# Altium schematic sheet LTC3260.SchDoc
size A4
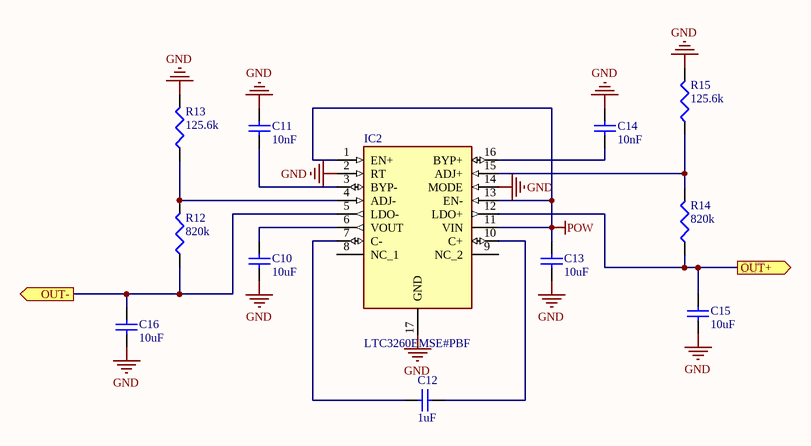
[diagram p0: LTC3260.SchDoc]

## Parts
C10  10uF  [0805 CAP]
C11  10nF  [0603 RES]
C12  1uF  [0805 CAP]
C13  10uF  [0805 CAP]
C14  10nF  [0603 RES]
C15  10uF  [0805 CAP]
C16  10uF  [0805 CAP]
IC2  LTC3260EMSE#PBF  [SOP50P490X110-17N]
R12  value 820k  [0603 RES]  (hidden comment: Résistance)
R13  value 125.6k  [0603 RES]  (hidden comment: Résistance)
R14  value 820k  [0603 RES]  (hidden comment: Résistance)
R15  value 125.6k  [0603 RES]  (hidden comment: Résistance)

## Ports
OUT+ (out), OUT- (out)

## Nets
GND: C10.2 C11.1 C13.1 C14.2 C15.2 C16.2 IC2.2(RT) IC2.14(MODE) IC2.17(GND) R13.2 R15.2
POW: C13.2 IC2.1(EN+) IC2.11(VIN) IC2.13(EN-)
OUT+: C15.1 IC2.12(LDO+) R14.1 ; port OUT+
OUT-: C16.1 IC2.5(LDO-) R12.1 ; port OUT-
NetC10_1: C10.1 IC2.6(VOUT)
NetC11_2: C11.2 IC2.3(BYP-)
NetC12_1: C12.1 IC2.7(C-)
NetC12_2: C12.2 IC2.10(C+)
NetC14_1: C14.1 IC2.16(BYP+)
NetIC2_4: IC2.4(ADJ-) R12.2 R13.1
NetIC2_15: IC2.15(ADJ+) R14.2 R15.1

Not connected (* = marked no-connect by the designer): IC2 8(NC_1) 9(NC_2)

## Library data of the parts
C10 C13 C15 C16 = 1uF/0805: Manufacturer: Murata; Manufacturer Part Number: GCM21BR7YA105KA55L; Capacitance: 10 µF; Dielectric: X7R; Tolerance (%): ±10 %; Rated Voltage: 35 V; Supplier 1: Farnell; Stock 1: 3630; Pricing 1: 5=0.391, 50=0.21, 250=0.162, 500=0.111 (EUR); Case Size/Dimension: 0805; ComponentLink1URL: https://datasheet.ciiva.com/11616/product-11616620.pdf; ComponentLink1Description: https://datasheet.ciiva.com/11616/product-11616620.pdf; ComponentLink2URL: https://datasheet.ciiva.com/138/s0717e-138752.pdf; ComponentLink2Description: https://datasheet.ciiva.com/138/s0717e-138752.pdf; ComponentLink3URL: https://datasheet.ciiva.com/138/s0717e-138753.pdf; ComponentLink3Description: https://datasheet.ciiva.com/138/s0717e-138753.pdf; ComponentLink4URL: https://datasheet.ciiva.com/18183/getdatasheetpartid-251151-18183719.pdf; ComponentLink4Description: https://datasheet.ciiva.com/18183/getdatasheetpartid-251151-18183719.pdf; ComponentLink5URL: https://datasheet.ciiva.com/138/s0717e-138751.pdf; ComponentLink5Description: https://datasheet.ciiva.com/138/s0717e-138751.pdf; Supplier Part Number 1: 2494199
C11 C14 = 1uF/0805: Manufacturer: Murata; Manufacturer Part Number: GCM21BR7YA105KA55L; Dielectric: X7R; Tolerance (%): ±10 %; Rated Voltage: 35 V; Supplier 1: Farnell; Stock 1: 3630; Pricing 1: 5=0.391, 50=0.21, 250=0.162, 500=0.111 (EUR); Capacitance: 10 nF; Case Size/Dimension: 0805; ComponentLink1URL: https://datasheet.ciiva.com/11616/product-11616620.pdf; ComponentLink1Description: https://datasheet.ciiva.com/11616/product-11616620.pdf; ComponentLink2URL: https://datasheet.ciiva.com/138/s0717e-138752.pdf; ComponentLink2Description: https://datasheet.ciiva.com/138/s0717e-138752.pdf; ComponentLink3URL: https://datasheet.ciiva.com/138/s0717e-138753.pdf; ComponentLink3Description: https://datasheet.ciiva.com/138/s0717e-138753.pdf; ComponentLink4URL: https://datasheet.ciiva.com/18183/getdatasheetpartid-251151-18183719.pdf; ComponentLink4Description: https://datasheet.ciiva.com/18183/getdatasheetpartid-251151-18183719.pdf; ComponentLink5URL: https://datasheet.ciiva.com/138/s0717e-138751.pdf; ComponentLink5Description: https://datasheet.ciiva.com/138/s0717e-138751.pdf; Supplier Part Number 1: 2494199
C12 = 1uF/0805: Manufacturer: Murata; Manufacturer Part Number: GCM21BR7YA105KA55L; Capacitance: 1 µF; Dielectric: X7R; Tolerance (%): ±10 %; Rated Voltage: 35 V; Supplier 1: Farnell; Stock 1: 3630; Pricing 1: 5=0.391, 50=0.21, 250=0.162, 500=0.111 (EUR); Case Size/Dimension: 0805; ComponentLink1URL: https://datasheet.ciiva.com/11616/product-11616620.pdf; ComponentLink1Description: https://datasheet.ciiva.com/11616/product-11616620.pdf; ComponentLink2URL: https://datasheet.ciiva.com/138/s0717e-138752.pdf; ComponentLink2Description: https://datasheet.ciiva.com/138/s0717e-138752.pdf; ComponentLink3URL: https://datasheet.ciiva.com/138/s0717e-138753.pdf; ComponentLink3Description: https://datasheet.ciiva.com/138/s0717e-138753.pdf; ComponentLink4URL: https://datasheet.ciiva.com/18183/getdatasheetpartid-251151-18183719.pdf; ComponentLink4Description: https://datasheet.ciiva.com/18183/getdatasheetpartid-251151-18183719.pdf; ComponentLink5URL: https://datasheet.ciiva.com/138/s0717e-138751.pdf; ComponentLink5Description: https://datasheet.ciiva.com/138/s0717e-138751.pdf; Supplier Part Number 1: 2494199
IC2 = LTC3260EMSE#PBF: Integrated Circuit; Manufacturer_Name: Linear Technology; Datasheet Link: http://cds.linear.com/docs/en/datasheet/3260fa.pdf; Height: 1.1mm; Manufacturer_Part_Number: LTC3260EMSE#PBF; Mouser Part Number: 584-LTC3260EMSE#PBF; Mouser Price/Stock: https://www.mouser.com/Search/Refine.aspx?Keyword=584-LTC3260EMSE%23PBF; RS Part Number: 8516768P; RS Price/Stock: http://uk.rs-online.com/web/p/products/8516768P
R12-R15 = Résistance: Résistance standard; Designer: ECAM 2005; Type: Résistance standard